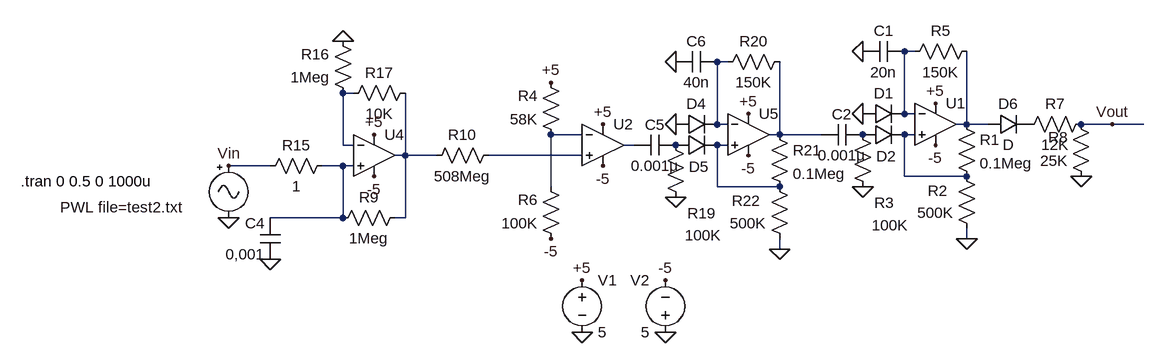
[diagram p0: schematic Leak-5_7ms.asc]
Leak-5_7ms.asc, the LTspice schematic file:
Version 4
SHEET 1 2784 1552
WIRE 528 -336 512 -336
WIRE 240 -320 224 -320
WIRE -336 -272 -352 -272
WIRE 512 -240 512 -336
WIRE 528 -240 512 -240
WIRE 224 -224 224 -320
WIRE 240 -224 224 -224
WIRE 608 -224 608 -336
WIRE 608 -224 592 -224
WIRE 640 -224 608 -224
WIRE 832 -224 784 -224
WIRE 880 -224 832 -224
WIRE 16 -208 -32 -208
WIRE 320 -208 320 -320
WIRE 320 -208 304 -208
WIRE 384 -208 320 -208
WIRE 528 -208 512 -208
WIRE -352 -192 -352 -272
WIRE -336 -192 -352 -192
WIRE 96 -192 80 -192
WIRE 240 -192 224 -192
WIRE -256 -176 -256 -272
WIRE -256 -176 -272 -176
WIRE -208 -176 -256 -176
WIRE 16 -176 -128 -176
WIRE -464 -160 -528 -160
WIRE -352 -160 -384 -160
WIRE -336 -160 -352 -160
WIRE 512 -144 512 -208
WIRE 608 -144 512 -144
WIRE -32 -128 -32 -208
WIRE 224 -128 224 -192
WIRE 320 -128 224 -128
WIRE -352 -80 -352 -160
WIRE -352 -80 -464 -80
WIRE -256 -80 -256 -176
WIRE -256 -80 -272 -80
WIRE 608 -48 608 -64
WIRE 320 -32 320 -48
FLAG -528 -80 0
FLAG 272 -240 +5
FLAG 272 -176 -5
FLAG 160 -224 0
FLAG 160 -320 0
FLAG 160 -112 0
FLAG 320 -32 0
FLAG -304 -208 +5
FLAG -304 -144 -5
FLAG -464 -16 0
FLAG -352 -352 0
FLAG 16 96 0
FLAG 144 96 0
FLAG 144 16 -5
FLAG 16 16 +5
FLAG 48 -224 +5
FLAG 48 -160 -5
FLAG -32 -48 -5
FLAG -32 -288 +5
FLAG 560 -256 +5
FLAG 560 -192 -5
FLAG 448 -240 0
FLAG 448 -336 0
FLAG 448 -128 0
FLAG 608 -48 0
FLAG 784 -144 0
FLAG -528 -160 Vin
FLAG 832 -224 Vout
SYMBOL res -368 -176 R90
WINDOW 0 0 56 VBottom 2
WINDOW 3 32 56 VTop 2
SYMATTR InstName R15
SYMATTR Value 1
SYMBOL Opamps\\UniversalOpamp2 272 -208 R0
SYMATTR InstName U5
SYMBOL diode 160 -208 R270
WINDOW 0 32 32 VTop 2
WINDOW 3 0 32 Invisible 2
SYMATTR InstName D4
SYMBOL diode 160 -176 R270
WINDOW 0 -33 36 VTop 2
WINDOW 3 0 32 Invisible 2
SYMATTR InstName D5
SYMBOL res 304 -224 R0
SYMATTR InstName R21
SYMATTR Value 0.1Meg
SYMBOL res 336 -32 R180
WINDOW 0 45 74 Left 2
WINDOW 3 36 40 Left 2
SYMATTR InstName R22
SYMATTR Value 500K
SYMBOL res 144 -208 R0
WINDOW 0 34 121 Left 2
WINDOW 3 30 155 Left 2
SYMATTR InstName R19
SYMATTR Value 100K
SYMBOL res 336 -336 R90
WINDOW 0 0 56 VBottom 2
WINDOW 3 32 56 VTop 2
SYMATTR InstName R20
SYMATTR Value 150K
SYMBOL cap 224 -336 R90
WINDOW 0 0 32 VBottom 2
WINDOW 3 32 32 VTop 2
SYMATTR InstName C6
SYMATTR Value 40n
SYMBOL cap 160 -208 R90
WINDOW 0 0 32 VBottom 2
WINDOW 3 32 32 VTop 2
SYMATTR InstName C5
SYMATTR Value 0.001µ
SYMBOL Opamps\\UniversalOpamp2 -304 -176 R0
SYMATTR InstName U4
SYMBOL cap -448 -16 R180
WINDOW 0 24 56 Left 2
WINDOW 3 24 8 Left 2
SYMATTR InstName C4
SYMATTR Value 0,001
SYMBOL res -240 -288 R90
WINDOW 0 0 56 VBottom 2
WINDOW 3 32 56 VTop 2
SYMATTR InstName R17
SYMATTR Value 10K
SYMBOL res -336 -256 R180
WINDOW 0 36 76 Left 2
WINDOW 3 36 40 Left 2
SYMATTR InstName R16
SYMATTR Value 1Meg
SYMBOL voltage 16 0 R0
WINDOW 123 0 0 Left 2
WINDOW 39 0 0 Left 2
SYMATTR InstName V1
SYMATTR Value 5
SYMBOL voltage 144 112 R180
WINDOW 0 24 96 Left 2
WINDOW 3 24 16 Left 2
WINDOW 123 0 0 Left 2
WINDOW 39 0 0 Left 2
SYMATTR InstName V2
SYMATTR Value 5
SYMBOL Misc\\signal -528 -176 R0
WINDOW 0 24 16 Invisible 2
WINDOW 3 -259 80 Left 2
WINDOW 123 0 0 Left 2
WINDOW 39 0 0 Left 2
SYMATTR InstName V3
SYMATTR Value PWL file=test2.txt
SYMBOL Opamps\\UniversalOpamp2 48 -192 R0
SYMATTR InstName U2
SYMBOL res -16 -192 R180
WINDOW 0 36 76 Left 2
WINDOW 3 36 40 Left 2
SYMATTR InstName R4
SYMATTR Value 58K
SYMBOL res -16 -32 R180
WINDOW 0 36 76 Left 2
WINDOW 3 36 40 Left 2
SYMATTR InstName R6
SYMATTR Value 100K
SYMBOL Opamps\\UniversalOpamp2 560 -224 R0
SYMATTR InstName U1
SYMBOL diode 448 -224 R270
WINDOW 0 32 32 VTop 2
WINDOW 3 0 32 Invisible 2
SYMATTR InstName D1
SYMBOL diode 448 -192 R270
WINDOW 0 -33 36 VTop 2
WINDOW 3 0 32 Invisible 2
SYMATTR InstName D2
SYMBOL res 592 -240 R0
SYMATTR InstName R1
SYMATTR Value 0.1Meg
SYMBOL res 624 -48 R180
WINDOW 0 45 74 Left 2
WINDOW 3 36 40 Left 2
SYMATTR InstName R2
SYMATTR Value 500K
SYMBOL res 432 -224 R0
WINDOW 0 34 121 Left 2
WINDOW 3 30 155 Left 2
SYMATTR InstName R3
SYMATTR Value 100K
SYMBOL res 624 -352 R90
WINDOW 0 0 56 VBottom 2
WINDOW 3 32 56 VTop 2
SYMATTR InstName R5
SYMATTR Value 150K
SYMBOL cap 512 -352 R90
WINDOW 0 0 32 VBottom 2
WINDOW 3 32 32 VTop 2
SYMATTR InstName C1
SYMATTR Value 20n
SYMBOL cap 448 -224 R90
WINDOW 0 0 32 VBottom 2
WINDOW 3 32 32 VTop 2
SYMATTR InstName C2
SYMATTR Value 0.001µ
SYMBOL diode 640 -208 R270
WINDOW 0 32 32 VTop 2
WINDOW 3 0 32 VBottom 2
SYMATTR InstName D6
SYMBOL res 800 -240 R90
WINDOW 0 0 56 VBottom 2
WINDOW 3 32 56 VTop 2
SYMATTR InstName R7
SYMATTR Value 12K
SYMBOL res 800 -128 R180
WINDOW 0 36 76 Left 2
WINDOW 3 36 40 Left 2
SYMATTR InstName R8
SYMATTR Value 25K
SYMBOL res -256 -96 R90
WINDOW 0 0 56 VBottom 2
WINDOW 3 32 56 VTop 2
SYMATTR InstName R9
SYMATTR Value 1Meg
SYMBOL res -112 -192 R90
WINDOW 0 0 56 VBottom 2
WINDOW 3 32 56 VTop 2
SYMATTR InstName R10
SYMATTR Value 508Meg
TEXT -848 -136 Left 2 !.tran 0 0.5 0 1000u

The netlist it stands for:
* Leak-5_7ms.asc
R15 N012 Vin 1
XU5 N009 N002 +5 -5 N006 level.2 Avol=1Meg GBW=10Meg Slew=10Meg ilimit=25m rail=0 Vos=0 phimargin=45 en=0 enk=0 in=0 ink=0 Rin=500Meg  ; pins IN+ IN- V+ V- OUT
D4 0 N002 D
D5 P001 N009 D
R21 N006 N009 0.1Meg
R22 0 N009 500K
R19 P001 0 100K
R20 N006 N002 150K
C6 N002 0 40n
C5 P001 N008 0.001µ
XU4 N012 N003 +5 -5 N010 level.2 Avol=1Meg GBW=10Meg Slew=10Meg ilimit=25m rail=0 Vos=0 phimargin=45 en=0 enk=0 in=0 ink=0 Rin=500Meg  ; pins IN+ IN- V+ V- OUT
C4 0 N012 0,001
R17 N010 N003 10K
R16 N003 0 1Meg
V1 +5 0 5
V2 0 -5 5
V3 Vin 0 PWL file=test2.txt
XU2 N011 N005 +5 -5 N008 level.2 Avol=1Meg GBW=10Meg Slew=10Meg ilimit=25m rail=0 Vos=0 phimargin=45 en=0 enk=0 in=0 ink=0 Rin=500Meg  ; pins IN+ IN- V+ V- OUT
R4 N005 +5 58K
R6 -5 N005 100K
XU1 N007 N001 +5 -5 N004 level.2 Avol=1Meg GBW=10Meg Slew=10Meg ilimit=25m rail=0 Vos=0 phimargin=45 en=0 enk=0 in=0 ink=0 Rin=500Meg  ; pins IN+ IN- V+ V- OUT
D1 0 N001 D
D2 P002 N007 D
R1 N004 N007 0.1Meg
R2 0 N007 500K
R3 P002 0 100K
R5 N004 N001 150K
C1 N001 0 20n
C2 P002 N006 0.001µ
D6 N004 P003 D
R7 Vout P003 12K
R8 0 Vout 25K
R9 N010 N012 1Meg
R10 N011 N010 508Meg
.model D D
.lib standard.dio
.tran 0 0.5 0 1000u
.lib UniversalOpamps2.sub
.backanno
.end